# Altium schematic sheet Current_DC_Sense.SchDoc
size 431 x 279 mm; Organization: ORGANIZATION; Address1: ADDRESS 1; Address2: ADDRESS 2; Address3: ADDRESS 3; Address4: ADDRESS 4; Revision: -; SheetNumber: 6; SheetTotal: 7; ENG_APP_DATE: --/--/--; DSN_APP_DATE: --/--/--; CHK_APP_DATE: --/--/--
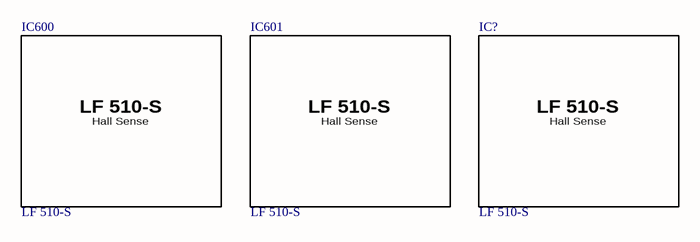
[diagram p0: Current_DC_Sense.SchDoc]

## Parts
IC600  LF 510-S  [LF 510-S]
IC601  LF 510-S  [LF 510-S]
IC?  LF 510-S  [LF 510-S]

## Notes on the sheet
- DWG. NO.
- REV.
- SHT.
- THIS DOCUMENT AND THE DATA DISCLOSED HEREIN OR HEREWITH IS THE PROPERTY OF ALTIUM LIMITED AND MAY BE FREELY DISTRIBUTED IN WHOLE. NO RIGHTS ARE RESERVED OR EXPRESS OR IMPLIED WARANTEE GIVEN.
- REVISION
- DESCRIPTION
- DATE
- APPROVED
- ENG:
- APPROVALS
- PROJECT
- DSN:
- CHK:
- REFERENCE DOCUMENTS
- PROJECT REVISION:
- TITLE
- DOCUMENT REVISION:
- DESIGN ITEM:
- BOM:
- FAB DWG:
- PCB DWG:
- ASSY DWG:
- SCALE:
- SIZE
- B
- CAGE CODE
- FILE NAME
- DWG NO.
- SHEET
- OF
- REV
- (in symbol 060-0001) Hall Sense

## Library data of the parts
IC600 IC601 IC? = 060-0001: Sensores de corriente industriales Current Transducer LF 510-S. For the electronic measurement of current: DC, AC, pulsed, with galvanic separation between the primary and secondary circuit.; Manufacturer: LEM; Value: 500A; ComponentLink1Description: Datasheet; ComponentLink1URL: https://www.lem.com/sites/default/files/products_datasheets/lf_510-s.pdf; ComponentLink2Description: Distributor Link; ComponentLink2URL: https://www.mouser.es/ProductDetail/LEM/LF-510-S?qs=Vi0JKjFBtYlrxHjwN8JfEg%3D%3D; ID: 060-0001; Package: 70x70x30mm; MPN: LF 510-S; Distributor PN: 61-LF510-S; Distributor: Mouser